# Altium schematic sheet STM32F103_sensor_v0.0.SchDoc
size A4
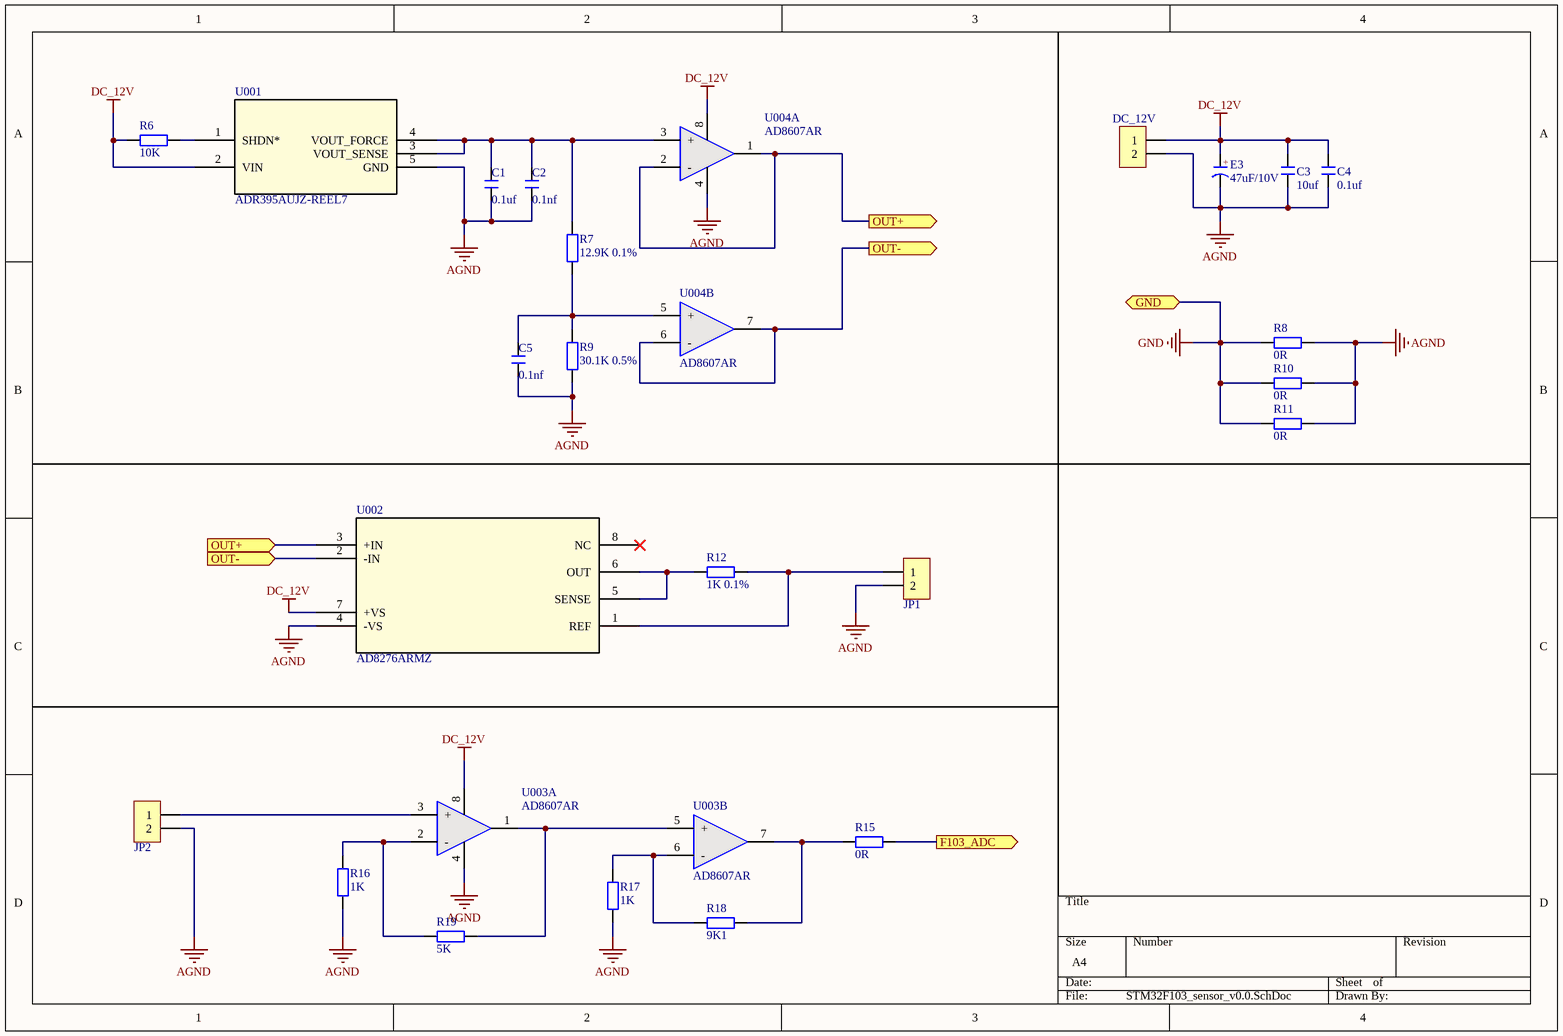
[diagram p0: STM32F103_sensor_v0.0.SchDoc]

## Parts
C1  0.1uf  [C 0603]
C2  0.1nf  [C 0603]
C3  10uf  [C 0603]
C4  0.1uf  [C 0603]
C5  0.1nf  [C 0603]
DC_12V  HDR-1X2  [HDR-1X2]  (value not drawn)
E3  47uF/10V  [CT 5*6 - C]
JP1  HDR-1X2  [HDR-1X2]  (value not drawn)
JP2  HDR-1X2  [HDR-1X2]  (value not drawn)
R6  10K  [R 0805]
R7  12.9K 0.1%  [R 0805]
R8  0R  [R 1206]
R9  30.1K 0.5%  [R 0805]
R10  0R  [R 1206]
R11  0R  [R 1206]
R12  1K 0.1%  [R 0805]
R15  0R  [R 0805]
R16  1K  [R 0805]
R17  1K  [R 0805]
R18  9K1  [R 0805]
R19  5K  [R 0805]
U001  ADR395AUJZ-REEL7  [SOT23-5L]
U002  AD8276ARMZ  [RM_8]
U003  AD8607AR  [SOP8_N]  (parts A,B of 2)
U004  AD8607AR  [SOP8_N]  (parts A,B of 2)

## Ports
F103_ADC (out), GND, OUT+ (in), OUT+ (out), OUT- (in), OUT- (out)

## Nets
AGND: C1.1 C2.1 C3.1 C4.1 C5.1 DC_12V.2 E3.2(K) JP1.2 JP2.2 R8.2 R9.2 R10.2 R11.2 R16.1 R17.1 U001.5(GND) U002.4(-VS) U003.4(V-) U004.4(V-)
DC_12V: C3.2 C4.2 DC_12V.1 E3.1(A) R6.2 U001.2(VIN) U002.7(+VS) U003.8(V+) U004.8(V+)
GND: R8.1 R10.1 R11.1 ; port GND
F103_ADC: R15.2 ; port F103_ADC
OUT+: U002.3(+IN) U004.1(OUT1) U004.2(-) ; port OUT+
OUT-: U002.2(-IN) U004.6(-) U004.7(OUT2) ; port OUT-
NetC1_2: C1.2 C2.2 R7.1 U001.3(VOUT_SENSE) U001.4(VOUT_FORCE) U004.3(+)
NetC5_2: C5.2 R7.2 R9.1 U004.5(+)
NetJP1_1: JP1.1 R12.2 U002.1(REF)
NetJP2_1: JP2.1 U003.3(+)
NetR6_1: R6.1 U001.1(SHDN*)
NetR12_1: R12.1 U002.5(SENSE) U002.6(OUT)
NetR15_1: R15.1 R18.1 U003.7(OUT2)
NetR16_2: R16.2 R19.2 U003.2(-)
NetR17_2: R17.2 R18.2 U003.6(-)
NetR19_1: R19.1 U003.1(OUT1) U003.5(+)

Not connected (* = marked no-connect by the designer): U002 8(NC)*

## Notes on the sheet
- (in symbol C-CT) +

## Library data of the parts
C1-C5 = C: 无极性贴片电容; 版权归属: 源创客; BOM名称: 无极性贴片电容; 学习资源: www.ooocke.com
DC_12V JP1 JP2 = Header 2: 2P接插件; 版权归属: 源创客; BOM名称: 2P接插件; 学习资源: www.ooocke.com
E3 = C-CT: 贴片固态电容; 版权归属: 源创客; BOM名称: 贴片固态电容; 学习资源: www.ooocke.com
R6-R12 R15-R19 = R: 贴片电阻; 版权归属: 源创客; BOM名称: 贴片电阻; 学习资源: www.ooocke.com
U003 U004 = AD8607AR: 双运放; 版权归属: 源创客; BOM名称: 双运放; 学习资源: www.ooocke.com